# Altium schematic sheet Connectors.SchDoc
size A; SheetNumber: 13
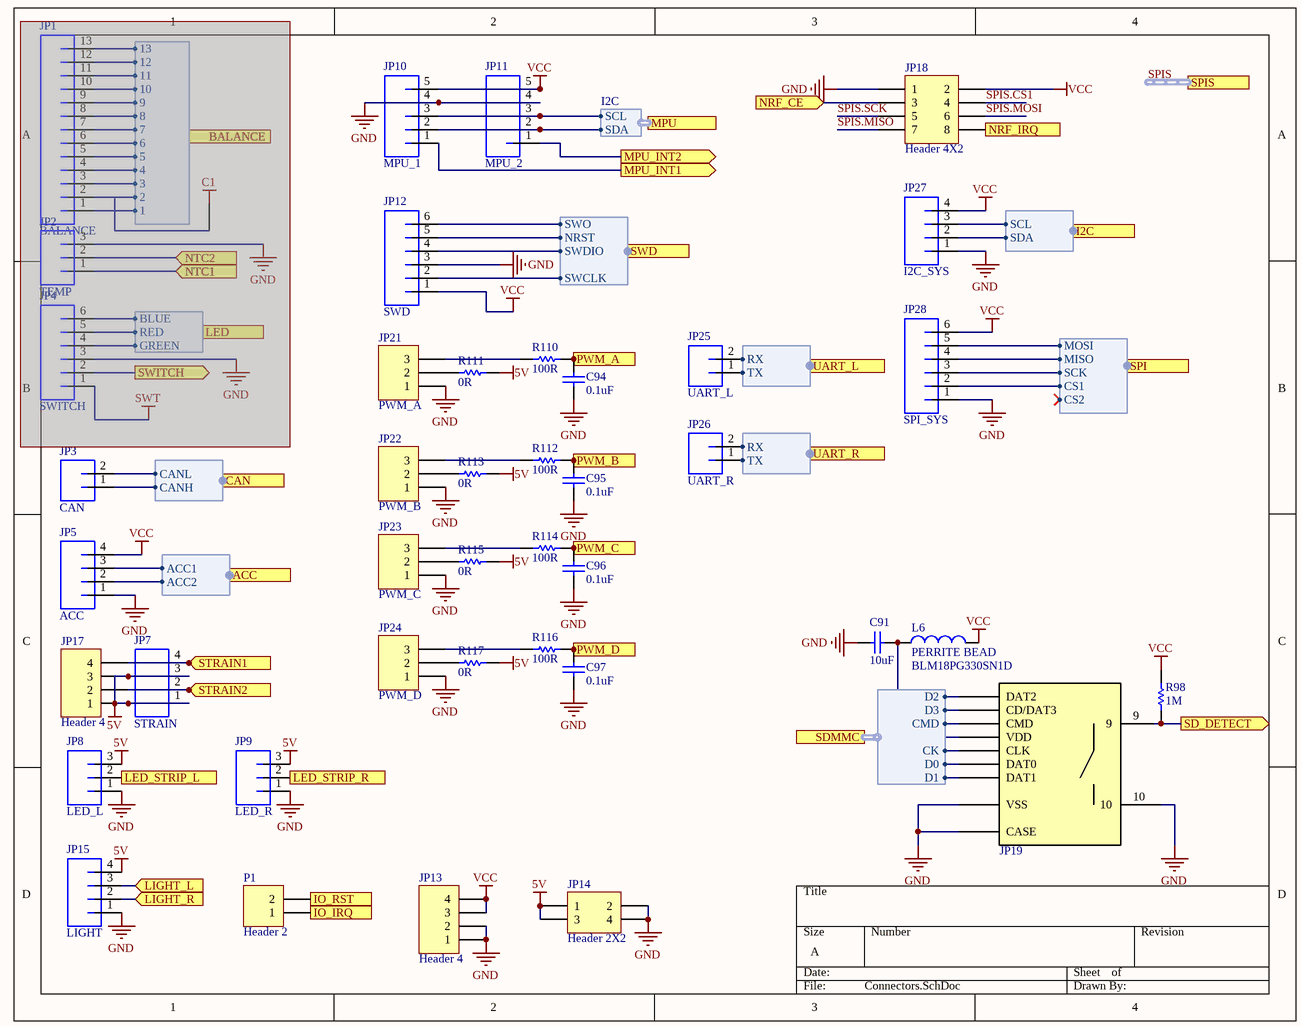
[diagram p0: Connectors.SchDoc]

## Parts
*1  NetTie  [NetTie]  (value not drawn)  (net tie, no BOM)  (masked out: inside a compile mask, not in the netlist)
C91  value 10uF  [C0603[1608X92]]  (hidden comment: 10uF 16V 0603)
C94  value 0.1uF  [C0603[1608X92]]  (hidden comment: 0.1uF 16V 0603)
C95  value 0.1uF  [C0603[1608X92]]  (hidden comment: 0.1uF 16V 0603)
C96  value 0.1uF  [C0603[1608X92]]  (hidden comment: 0.1uF 16V 0603)
C97  value 0.1uF  [C0603[1608X92]]  (hidden comment: 0.1uF 16V 0603)
JP1  BALANCE  [JST-XH-13-PTH-VERT]  (masked out: inside a compile mask, not in the netlist)
JP2  TEMP  [JST-PH-3-PTH-VERT]  (masked out: inside a compile mask, not in the netlist)
JP3  CAN  [JST-PH-2-PTH-VERT]
JP4  SWITCH  [JST-PH-6-PTH-VERT]  (masked out: inside a compile mask, not in the netlist)
JP5  ACC  [JST-PH-4-PTH-VERT]
JP7  STRAIN  [Terminal-3.81-HORZ]
JP8  LED_L  [JST-PH-3-PTH-VERT]
JP9  LED_R  [JST-PH-3-PTH-VERT]
JP10  MPU_1  [JST-PH-5-PTH-VERT]
JP11  MPU_2  [JST-PH-5-PTH-VERT]
JP12  SWD  [MOLEX_5045_6]
JP13  Header 4  [HDR1X4]
JP14  Header 2X2  [HDR2X2]
JP15  LIGHT  [JST-PH-4-PTH-VERT]
JP17  Header 4  [HDR1X4]
JP18  Header 4X2  [HDR2X4]
JP19  MICRO SD TOP MOUNT  [MICRO SD_502570]  (value not drawn)
JP21  PWM_A  [HDR1X3]
JP22  PWM_B  [HDR1X3]
JP23  PWM_C  [HDR1X3]
JP24  PWM_D  [HDR1X3]
JP25  UART_L  [JST-PH-2-PTH-VERT]
JP26  UART_R  [JST-PH-2-PTH-VERT]
JP27  I2C_SYS  [JST-PH-4-PTH-VERT]
JP28  SPI_SYS  [JST-PH-6-PTH-VERT]
L6  Type: PERRITE BEAD  PartNumber: BLM18PG330SN1D  [IND0603]  (hidden comment: 33Ohm)
P1  Header 2  [HDR1X2]
R98  value 1M  [R0603[1608]]  (hidden comment: 1M 5% 0603)
R110  value 100R  [R0603[1608]]  (hidden comment: 100R 1% 0603)
R111  value 0R  [R0603[1608]]  (hidden comment: 0R 1% 0603)
R112  value 100R  [R0603[1608]]  (hidden comment: 100R 1% 0603)
R113  value 0R  [R0603[1608]]  (hidden comment: 0R 1% 0603)
R114  value 100R  [R0603[1608]]  (hidden comment: 100R 1% 0603)
R115  value 0R  [R0603[1608]]  (hidden comment: 0R 1% 0603)
R116  value 100R  [R0603[1608]]  (hidden comment: 100R 1% 0603)
R117  value 0R  [R0603[1608]]  (hidden comment: 0R 1% 0603)

## Ports
ACC (harness Accessory Outputs), BALANCE (harness Balance), CAN (harness CAN Output), I2C (harness I2C), IO_IRQ (out), IO_RST (in), LED (harness LED), LED_STRIP_L (in), LED_STRIP_R (in), LIGHT_L (in), LIGHT_R (in), MPU (harness I2C), MPU_INT1 (out), MPU_INT2 (out), NRF_CE (in), NRF_IRQ (out), NTC1 (in), NTC2 (in), PWM_A (in), PWM_B (in), PWM_C (in), PWM_D (in), SD_DETECT (out), SDMMC (harness SDMMC), SPI (harness SPI), SPIS (harness SPI), STRAIN1 (in), STRAIN2 (in), SWD (harness SWD), SWITCH (out), UART_L (harness USART2), UART_R (harness USART2)

## Harnesses
Accessory Outputs: ACC1, ACC2
CAN Output: CANL, CANH
Balance: 13, 12, 11, 10, 9, 8, 6, 7, 5, 3, 4, 2, 1
I2C: SCL, SDA
SWD: SWCLK, SWDIO, SWO, NRST
LED: RED, BLUE, GREEN
SDMMC: D2, D3, CMD, CK, D0, D1
USART2: RX, TX
SPI: MISO, MOSI, CS1, SCK, CS2

## Nets
5V: JP7.1 JP7.3 JP8.3 JP9.3 JP14.1 JP14.3 JP15.4 JP17.1 JP17.3 R111.2 R113.2 R115.2 R117.2
GND: C91.2 C94.1 C95.1 C96.1 C97.1 JP5.1 JP8.1 JP9.1 JP10.4 JP11.4 JP12.3 JP13.1 JP13.2 JP14.2 JP14.4 JP15.1 JP18.1 JP19.10 JP19.CASE JP19.VSS JP21.1 JP22.1 JP23.1 JP24.1 JP27.1 JP28.1
VCC: JP5.4 JP10.5 JP11.5 JP12.1 JP13.3 JP13.4 JP18.2 JP27.4 JP28.6 L6.2 R98.1
IO_IRQ: P1.1 ; port IO_IRQ
IO_RST: P1.2 ; port IO_RST
LED_STRIP_L: JP8.2 ; port LED_STRIP_L
LED_STRIP_R: JP9.2 ; port LED_STRIP_R
LIGHT_L: JP15.3 ; port LIGHT_L
LIGHT_R: JP15.2 ; port LIGHT_R
MPU_INT1: JP10.1 ; port MPU_INT1
MPU_INT2: JP11.1 ; port MPU_INT2
NRF_CE: JP18.3 ; port NRF_CE
NRF_IRQ: JP18.8 ; port NRF_IRQ
PWM_A: C94.2 R110.2 ; port PWM_A
PWM_B: C95.2 R112.2 ; port PWM_B
PWM_C: C96.2 R114.2 ; port PWM_C
PWM_D: C97.2 R116.2 ; port PWM_D
SD_DETECT: JP19.9 R98.2 ; port SD_DETECT
SPIS.CS1: JP18.4
SPIS.MISO: JP18.7
SPIS.MOSI: JP18.6
SPIS.SCK: JP18.5
STRAIN1: JP7.4 JP17.4 ; port STRAIN1
STRAIN2: JP7.2 JP17.2 ; port STRAIN2
NetC91_1: C91.1 JP19.VDD L6.1
NetJP3_1: JP3.1 ; port CAN.CANH
NetJP3_2: JP3.2 ; port CAN.CANL
NetJP5_2: JP5.2 ; port ACC.ACC2
NetJP5_3: JP5.3 ; port ACC.ACC1
NetJP10_2: JP10.2 JP11.2 ; port MPU.SDA
NetJP10_3: JP10.3 JP11.3 ; port MPU.SCL
NetJP12_2: JP12.2 ; port SWD.SWCLK
NetJP12_4: JP12.4 ; port SWD.SWDIO
NetJP12_5: JP12.5 ; port SWD.NRST
NetJP12_6: JP12.6 ; port SWD.SWO
NetJP19_CD/DAT3: JP19.CD/DAT3 ; port SDMMC.D3
NetJP19_CLK: JP19.CLK ; port SDMMC.CK
NetJP19_CMD: JP19.CMD ; port SDMMC.CMD
NetJP19_DAT0: JP19.DAT0 ; port SDMMC.D0
NetJP19_DAT1: JP19.DAT1 ; port SDMMC.D1
NetJP19_DAT2: JP19.DAT2 ; port SDMMC.D2
NetJP21_2: JP21.2 R111.1
NetJP21_3: JP21.3 R110.1
NetJP22_2: JP22.2 R113.1
NetJP22_3: JP22.3 R112.1
NetJP23_2: JP23.2 R115.1
NetJP23_3: JP23.3 R114.1
NetJP24_2: JP24.2 R117.1
NetJP24_3: JP24.3 R116.1
NetJP25_1: JP25.1 ; port UART_L.TX
NetJP25_2: JP25.2 ; port UART_L.RX
NetJP26_1: JP26.1 ; port UART_R.TX
NetJP26_2: JP26.2 ; port UART_R.RX
NetJP27_2: JP27.2 ; port I2C.SDA
NetJP27_3: JP27.3 ; port I2C.SCL
NetJP28_2: JP28.2 ; port SPI.CS1
NetJP28_3: JP28.3 ; port SPI.SCK
NetJP28_4: JP28.4 ; port SPI.MISO
NetJP28_5: JP28.5 ; port SPI.MOSI

## Buses and harness runs
harness SPIS = port SPIS

## Library data of the parts
C91 = CAP_10uF_16V_0603_10%: 10uF 16V 10% 0603 (1608 Metric); PartNumber: GRM188R61C106KAALD; Manufacturer: Murata; TemperatureCoefficient: X5R; Mounting Technology: Surface Mount; PackageReference: 0603; PackageDescription: 0603 (1608 Metric); Voltage: 16V; Tolerance: 10%
C94-C97 = CAP_0.1uF_16V_0603_10%: 0.1uF 16V 10% 0603 (1608 Metric); PartNumber: GCM188R71C104KA37D; Manufacturer: Murata; TemperatureCoefficient: X7R; Mounting Technology: Surface Mount; PackageReference: 0603; PackageDescription: 0603 (1608 Metric); Voltage: 16V; Tolerance: 10%
JP1 = JST_XH_13_VERT: Manufacturer: JST Sales America, Inc.; PartNumber: B13B-XH-A(LF)(SN); Mounting Technology: Through Hole; PackageReference: JST-XH
JP2 JP8 JP9 = JST_PH_3_VERT: Manufacturer: JST Sales America Inc.; PartNumber: B3B-PH-K-S(LF)(SN); Mounting Technology: Through Hole; PackageReference: JST-PH
JP3 JP25 JP26 = JST_PH_2_VERT: Manufacturer: JST Sales America Inc.; PartNumber: B2B-PH-K-S(LF)(SN); Mounting Technology: Through Hole; PackageReference: JST-PH
JP4 JP28 = JST_PH_6_VERT: PartNumber: B6B-PH-K-S(LF)(SN); Manufacturer: JST Sales America Inc.; PackageReference: JST-PH; Mounting Technology: Through Hole
JP5 JP27 = JST_PH_4_VERT: Manufacturer: JST Sales America Inc.; PartNumber: B4B-PH-K-S(LF)(SN); PackageReference: JST-PH; Mounting Technology: Through Hole
JP7 = Terminal_MC 1,5/ 4-G-3,81: PartNumber: 1803293; Manufacturer: Phoenix Contact; MatePart: 1803594; PackageReference: MC; Mounting Technology: Through Hole
JP10 JP11 = JST_PH_5_VERT: Manufacturer: JST Sales America, Inc.; PartNumber: B5B-PH-K-S(LF)(SN); PackageReference: JST-PH; Mounting Technology: Through Hole
JP12 = MOLEX_5045_6: PartNumber: B6B-PH-K-S(LF)(SN); Manufacturer: JST Sales America Inc.; PackageReference: JST-PH; Mounting Technology: Through Hole
JP13 JP17 = Header 4: Header, 4-Pin; LatestRevisionDate: 17-Jul-2002; LatestRevisionNote: Re-released for DXP Platform.; Publisher: Altium Limited
JP14 = Header 2X2: Header, 2-Pin, Dual row; LatestRevisionDate: 17-Jul-2002; LatestRevisionNote: Re-released for DXP Platform.; Publisher: Altium Limited
JP15 = JST_PH_4_VERT: PartNumber: B4B-PH-K-S(LF)(SN); Manufacturer: JST Sales America Inc.; PackageReference: JST-PH; Mounting Technology: Through Hole
JP18 = Header 4X2: Header, 4-Pin, Dual row; LatestRevisionDate: 17-Jul-2002; LatestRevisionNote: Re-released for DXP Platform.; Publisher: Altium Limited
JP19 = MICRO SD_5025: MICRO SD Slot / TOP MOUNT / FRONT; Manufacturer: Molex; PartNumber: 5025700893; Mounting Technology: SMD; PackageReference: Header-1.27mm-2x5
JP21-JP24 = Header 3: Header, 3-Pin; LatestRevisionDate: 17-Jul-2002; LatestRevisionNote: Re-released for DXP Platform.; Publisher: Altium Limited
L6 = PER_33Ohm_3A_0603: 33Ohm 3A 0603 Perrite Bead; Manufacturer: Murata; PackageReference: 0603; PackageDescription: 0603 (1608 metric); Mounting Technology: Surface Mount; Current: 3A; Value: 33Ohm
P1 = Header 2: Header, 2-Pin; LatestRevisionDate: 17-Jul-2002; LatestRevisionNote: Re-released for DXP Platform.; Publisher: Altium Limited
R98 = RES_1M_0603_5%: 1M 0.25W 5% 0603 (1005 Metric); Manufacturer: Panasonic; PartNumber: ERJ-PA3J105V; Tolerance: 5%; Power: 0.25W; Mounting Technology: Surface Mount; PackageReference: 0603; PackageDescription: 0603 (1608 Metric); ComponentLink1Description: Datasheet; ComponentLink1URL: http://www.vishay.com/docs/20043/crcwhpe3.pdf
R110 R112 R114 R116 = RES_100R_0603_1%: 100R 0.25W 1% 0603 (1005 Metric); Manufacturer: Vishay / Dale; PartNumber: CRCW0603100RFKEAHP; Tolerance: 1%; Power: 0.25W; Mounting Technology: Surface Mount; PackageReference: 0603; PackageDescription: 0603 (1608 Metric); ComponentLink1Description: Datasheet; ComponentLink1URL: http://www.vishay.com/docs/20043/crcwhpe3.pdf
R111 R113 R115 R117 = RES_0R_0603_1%: 0R 0.25W 1% 0603 (1005 Metric); Manufacturer: Vishay / Dale; PartNumber: CRCW06030000Z0EAHP; Tolerance: 1%; Power: 0.25W; Mounting Technology: Surface Mount; PackageReference: 0603; PackageDescription: 0603 (1608 Metric); ComponentLink1Description: Datasheet; ComponentLink1URL: http://www.vishay.com/docs/20043/crcwhpe3.pdf